# Altium schematic sheet LB-word-PSU-24V.SchDoc
size A
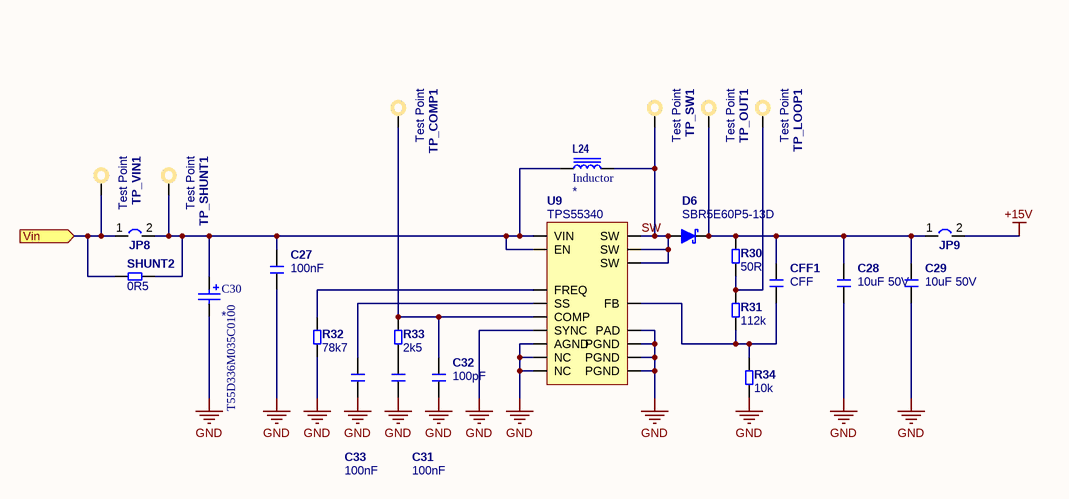
[diagram p0: LB-word-PSU-24V.SchDoc]

## Parts
C27  100nF  [C0603_N]
C28  10uF 50V  [C1210_N]
C29  10uF 50V  [C1210_N]
C30  T55D336M035C0100  [2917 - Case D]
C31  100nF  [C0603_N]
C32  100pF  [C0603_N]
C33  100nF  [C0603_N]
CFF1  CFF  [C0603_N]
D6  SBR5E60P5-13D  [PowerDI5]
JP8  Jumper 2W  [Jumper SMD 2W NO]  (value not drawn)
JP9  Jumper 2W  [Jumper SMD 2W NO]  (value not drawn)
L24  Inductor  [INDUCTOR SRP1040]
R30  50R  [R0603]
R31  112k  [R0603]
R32  78k7  [R0603]
R33  2k5  [R0603]
R34  10k  [R0603]
SHUNT2  0R5  [R0603]
TP_COMP1  Test Point  [TestPoint-1.2mm]
TP_LOOP1  Test Point  [TestPoint-1.2mm]
TP_OUT1  Test Point  [TestPoint-1.2mm]
TP_SHUNT1  Test Point  [TestPoint-1.2mm]
TP_SW1  Test Point  [TestPoint-1.2mm]
TP_VIN1  Test Point  [TestPoint-1.2mm]
U9  TPS55340  [QFN16]

## Ports
Vin (in)

## Nets
+15V: JP9.2
GND: C27.2 C28.2 C29.2 C30.2 C31.2 C32.2 C33.2 R32.1 R34.1 U9.5(SYNC) U9.6(AGND) U9.10(NC) U9.11(PGND) U9.12(PGND) U9.13(PGND) U9.14(NC) U9.PAD
SW: D6.A L24.2 TP_SW1.1 U9.1(SW) U9.15(SW) U9.16(SW)
Vin: JP8.1 SHUNT2.1 TP_VIN1.1 ; port Vin
NetC27_1: C27.1 C30.1 JP8.2 L24.1 SHUNT2.2 TP_SHUNT1.1 U9.2(VIN) U9.3(EN)
NetC28_1: C28.1 C29.1 CFF1.1 D6.K JP9.1 R30.2 TP_OUT1.1
NetC31_1: C31.1 R33.1
NetC32_1: C32.1 R33.2 TP_COMP1.1 U9.7(COMP)
NetC33_1: C33.1 U9.4(SS)
NetCFF1_2: CFF1.2 R31.1 R34.2 U9.8(FB)
NetR30_1: R30.1 R31.2 TP_LOOP1.1
NetR32_2: R32.2 U9.9(FREQ)

## Library data of the parts
C27-C29 C31-C33 CFF1 = Capacitor: Capacitor MLCC; Manufacturer: Yageo; Manufacturer Part Number: CC0603KRX7R9BB104; Tolerance (%): 10; Category: Capacitor; Package: 0603; Supplier Part Number 1: 1362556; Supplier 1: Farnell; ComponentLink1URL: http://www.yageo.com; ComponentLink1Description: Manufacturer Website; Voltage Rating (Volts): *; Supplier 2: Digi-Key; Supplier Part Number 2: 311-1344-1-ND
  C27 C31 C33: Value: 100nF
  C28 C29: Value: 10uF 50V
  C32: Value: 100pF
  CFF1: Value: CFF
C30 = Capacitor Polarized: Polarized Cap; Published: 17-Jul-2002; LatestRevisionDate: 19-Mar-2004; LatestRevisionNote: Silkscreen dimensions re-sized.; DatasheetDocument: Mar-2001; PackageDocument: Mar-2001; PackageReference: D; Publisher: Altium Limited; Code_JEITA: 7343-31; ComponentLink1Description: Manufacturer Link; ComponentLink1URL: http://www.kemet.com/; ComponentLink2Description: Datasheet; ComponentLink2URL: http://www.kemet.com/kemet/web/homepage/kechome.nsf/vapubfilesname/F3102TA.pdf/$file/F3102TA.pdf; Value: *
D6 = Diode Schottky
R30-R34 SHUNT2 = Resistor: Published: 17-Dec-2003; LatestRevisionDate: 19-Mar-2004; LatestRevisionNote: Silkscreen size reduced.; PackageDocument: Mar-2003; PackageReference: 3-0603; Publisher: Altium Limited; Code_IPC: 1608 [0603]; ComponentLink1Description: Manufacturer Link; ComponentLink1URL: http://www.panasonic.com/industrial/components/resistive_products.htm; ComponentLink2Description: Datasheet; ComponentLink2URL: http://www.panasonic.com/industrial/components/pdf/AOA0000CE2.pdf
  R30: Value: 50R
  R31: Value: 112k
  R32: Value: 78k7
  R33: Value: 2k5
  R34: Value: 10k
  SHUNT2: Value: 0R5
U9 = TPS55340: Boost/SEPIC/Flyback converter
L24 = Inductor: Value: *